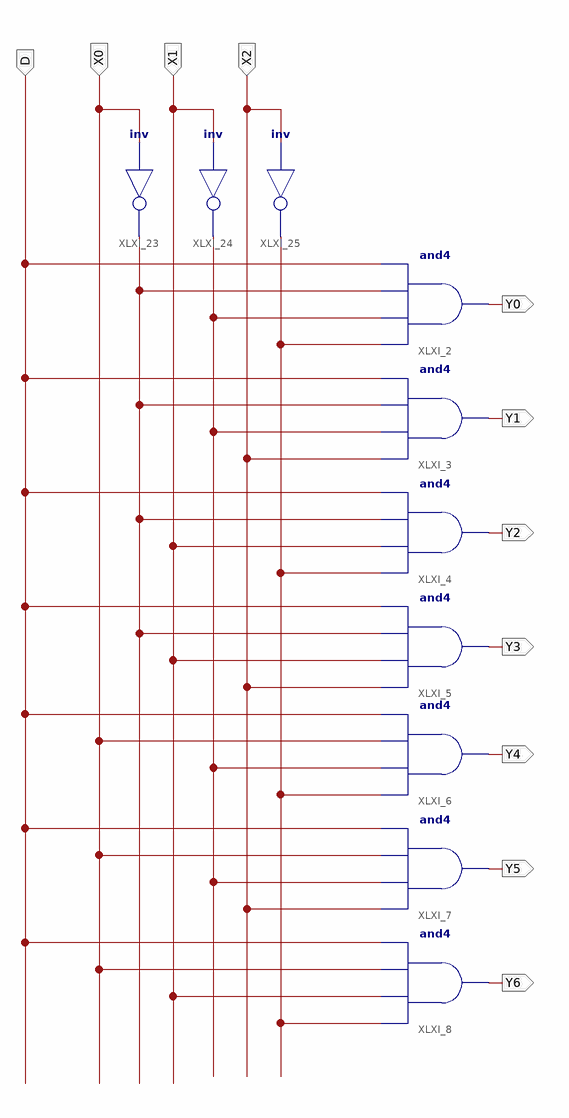
[diagram p0: schematic sheet 1]
// Xilinx ISE schematic Schem2.sch (virtex5) as structural Verilog: 10 symbols, 11 ports
module Schem2 (
  input  D,
  input  X1,
  input  X2,
  input  X0,
  output Y0,
  output Y1,
  output Y2,
  output Y3,
  output Y4,
  output Y5,
  output Y6
);

  wire XLXN_47, XLXN_51, XLXN_55;

  and XLXI_2 (Y0, XLXN_47, XLXN_55, XLXN_51, D);
  and XLXI_3 (Y1, X2, XLXN_55, XLXN_51, D);
  and XLXI_4 (Y2, XLXN_47, X1, XLXN_51, D);
  and XLXI_5 (Y3, X2, X1, XLXN_51, D);
  and XLXI_6 (Y4, XLXN_47, XLXN_55, X0, D);
  and XLXI_7 (Y5, X2, XLXN_55, X0, D);
  and XLXI_8 (Y6, XLXN_47, X1, X0, D);
  not XLXI_23 (XLXN_51, X0);
  not XLXI_24 (XLXN_55, X1);
  not XLXI_25 (XLXN_47, X2);
endmodule
